# EAGLE design LIC_V-00119-01 (EAGLE 7.2.0)
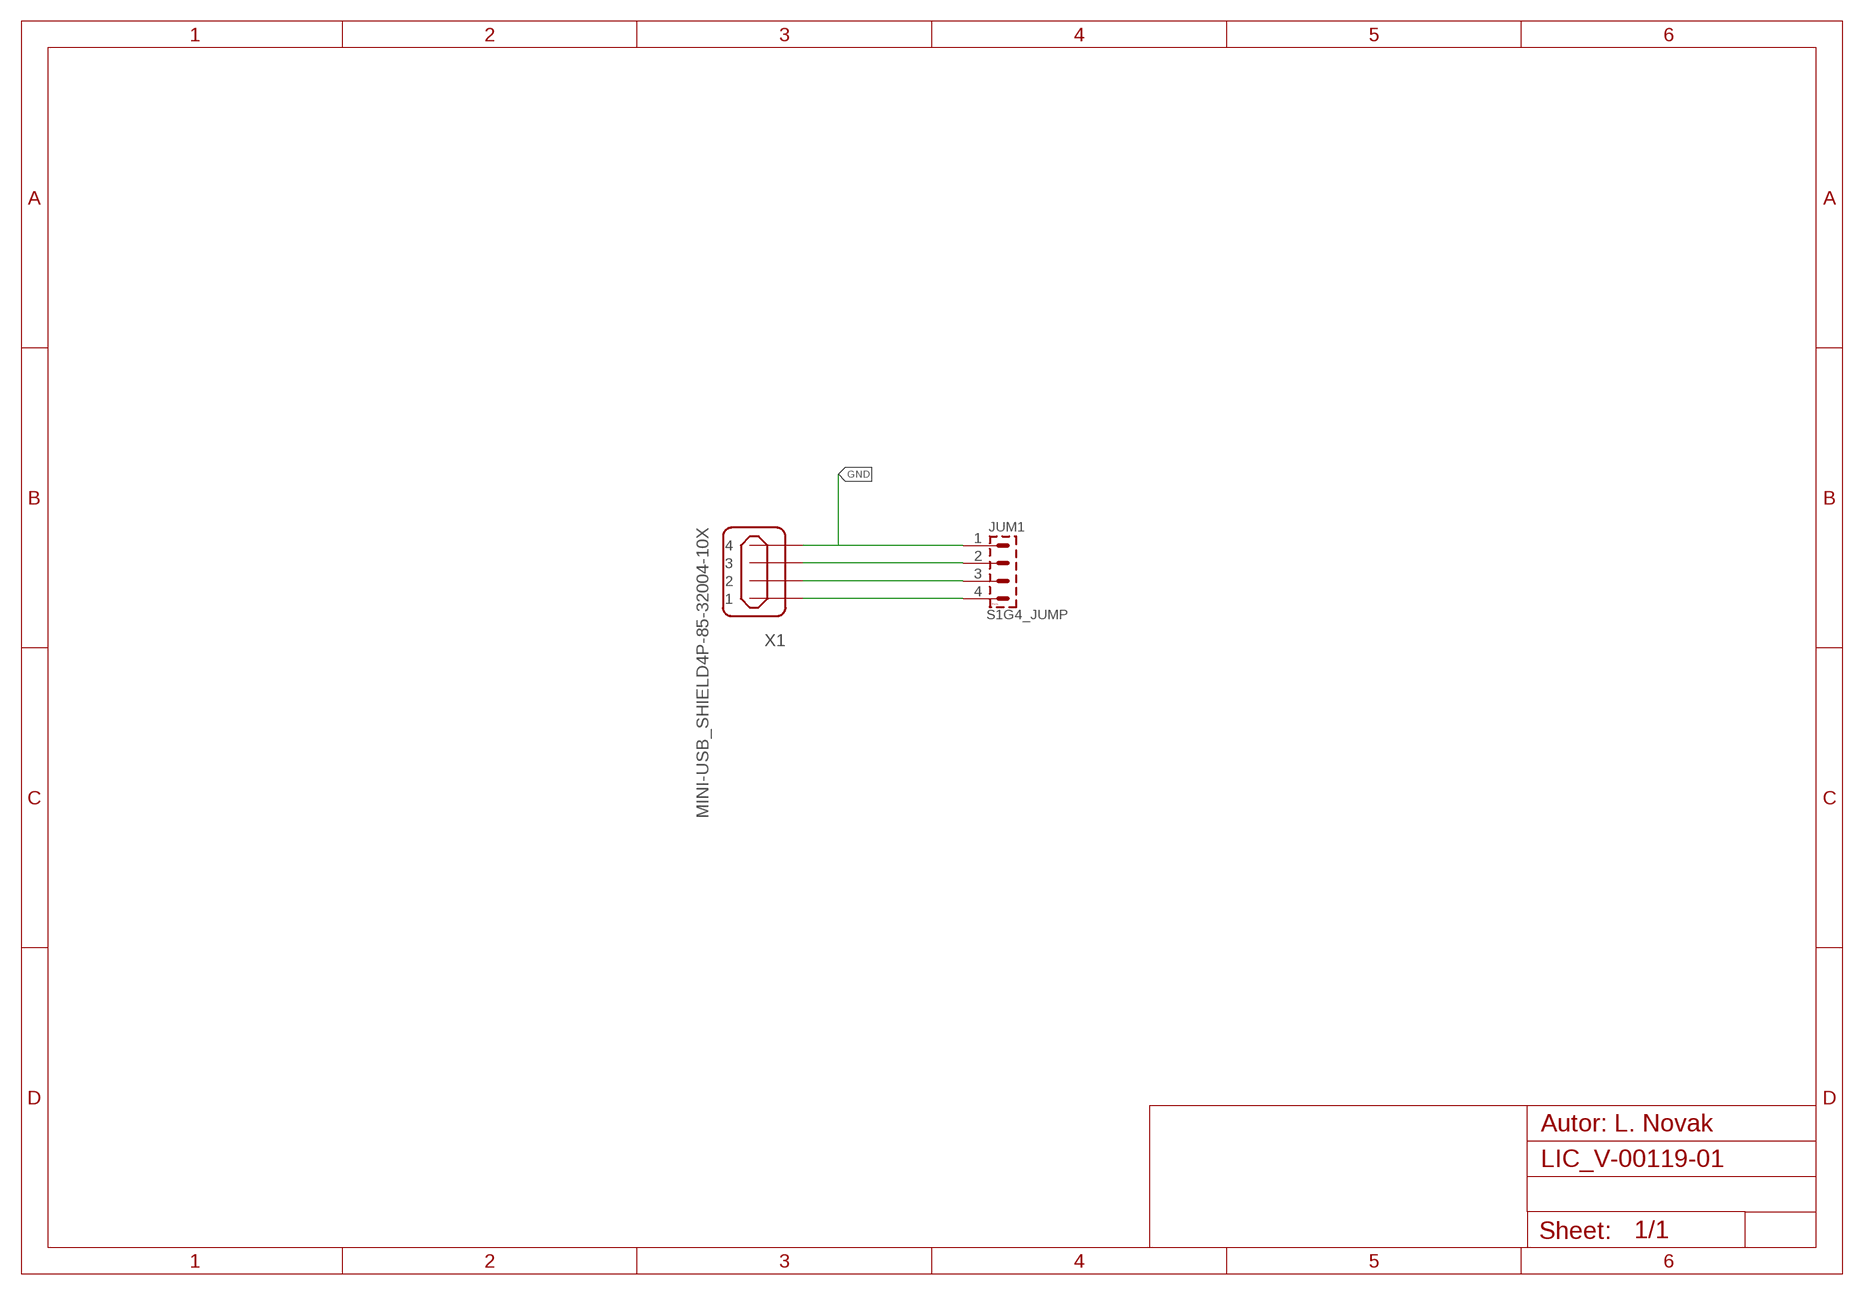
[diagram p0: schematic, sheet 1]

## Parts
JUM1  S1G4_JUMP  [S1G4_JUM]
X1  MINI-USB_SHIELD4P-85-32004-10X  [85-32004-10X]

## Nets
GND: JUM1.1 X1.4
N$2: JUM1.2 X1.3
N$3: JUM1.3 X1.2
N$4: JUM1.4 X1.1
Unconnected: X1.M1(S1) X1.M2(S2)

## Library data of the parts
JUM1 = #PaJa_konektory:S1G4_JUMP: Radove konektory - koliky - 4x
X1 = con-cypressindustries:MINI-USB_SHIELD4P-: MINI USB 4 Pol. Source: www.cypressindustries.com; OC_FARNELL: unknown; OC_NEWARK: unknown

## Board
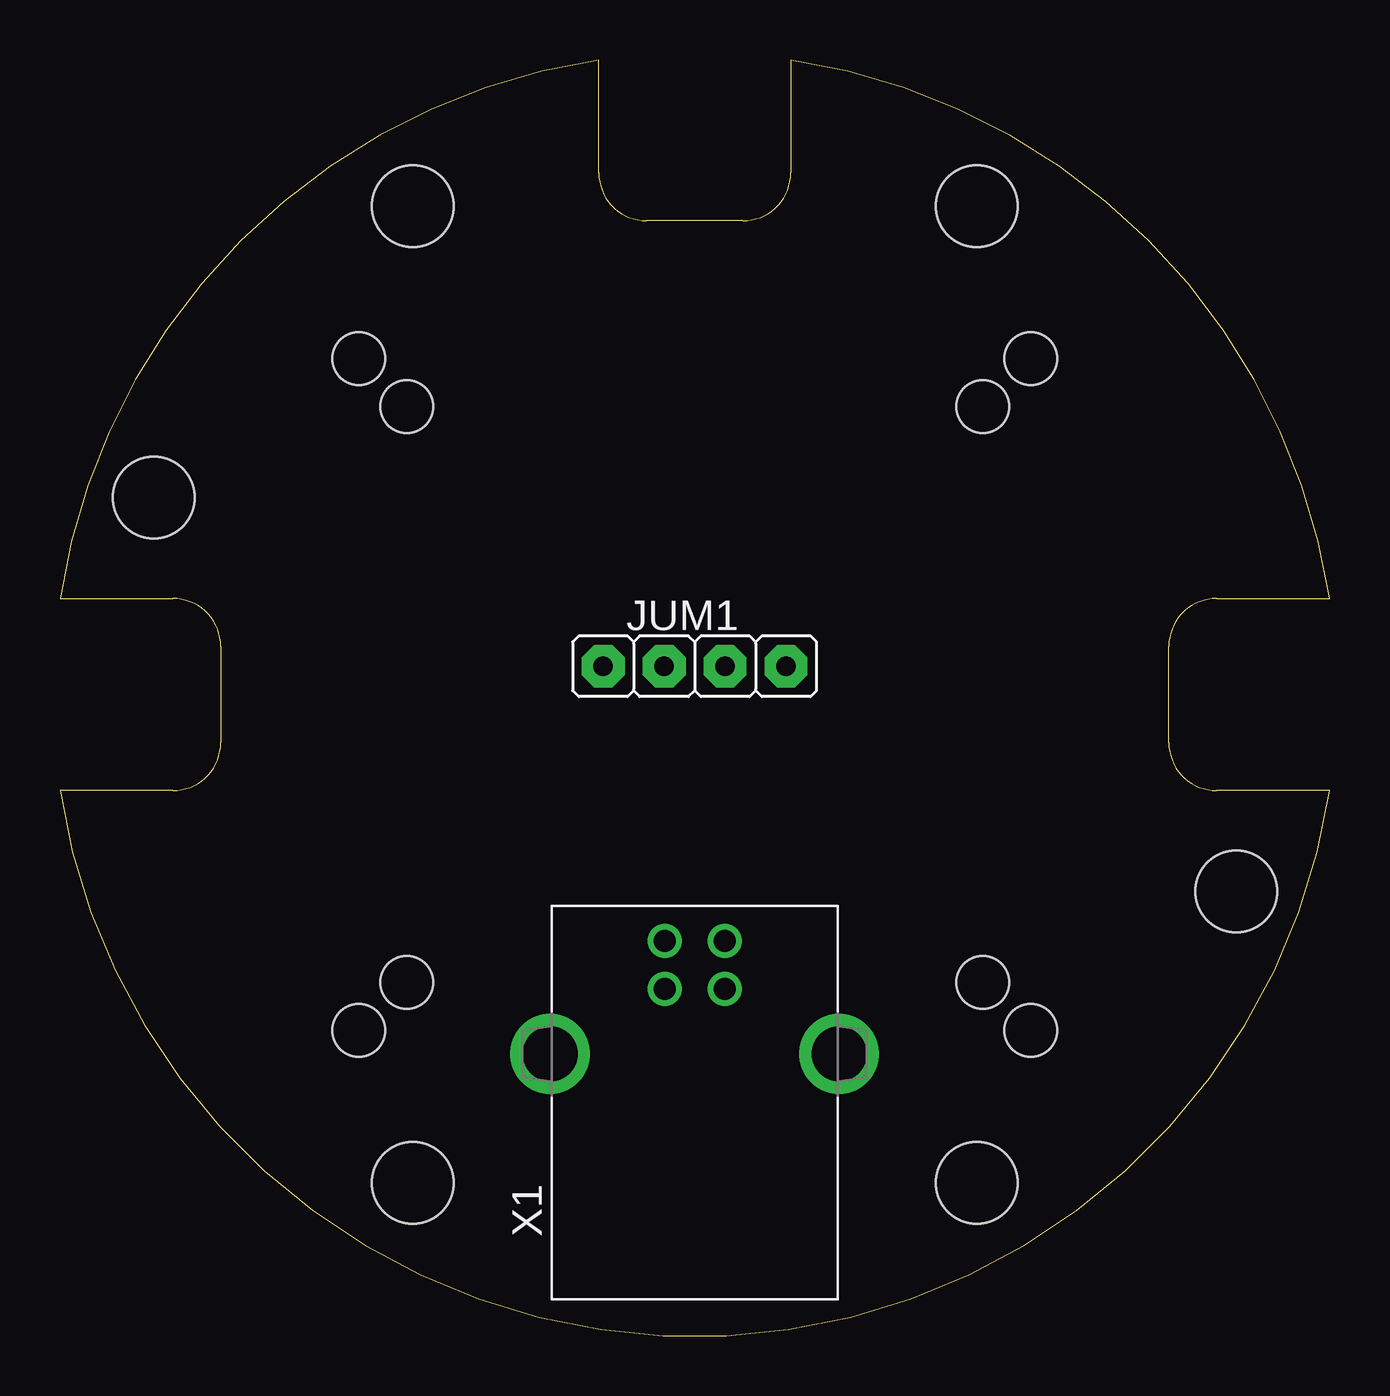
[diagram p1: board, top side]
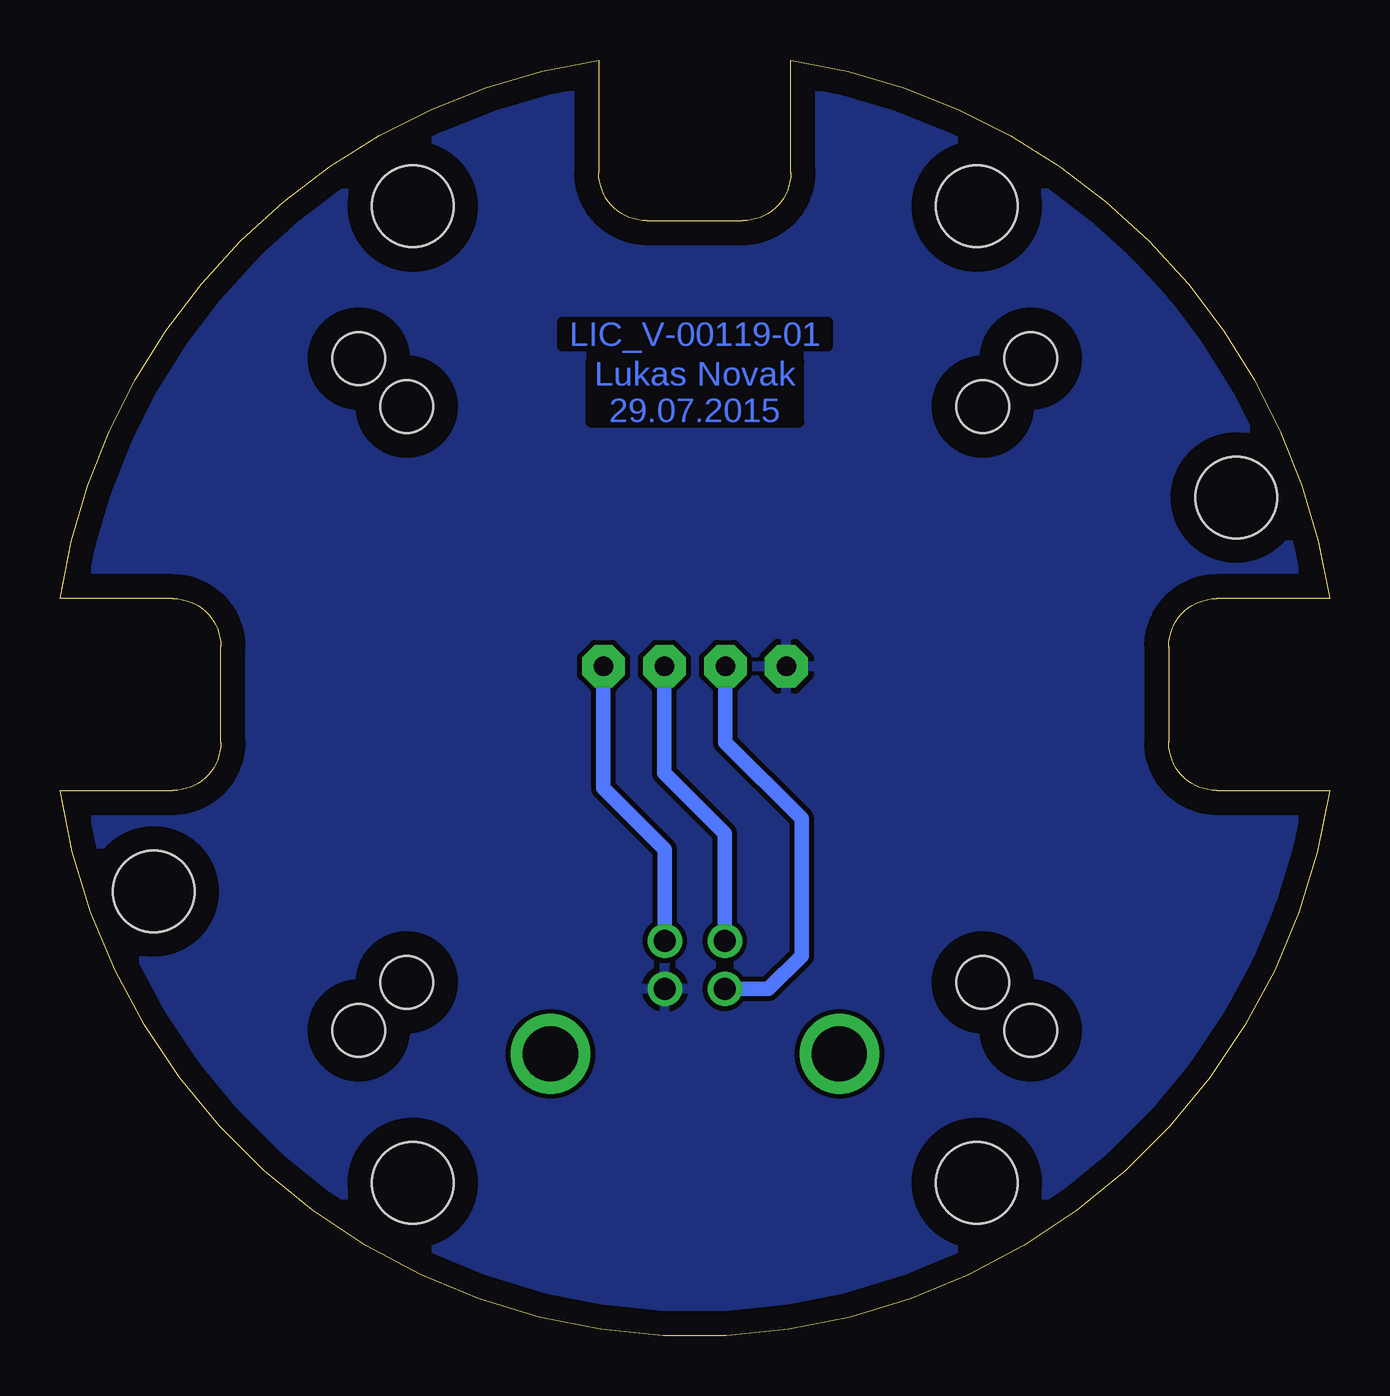
[diagram p2: board, bottom side, seen from below]

Size 52.9 x 53.17 mm. Coordinates in mm from the lower left corner, seen from the top.
Outline: 48.2,30.72 arc90 46.2,28.72 46.2,24.72 arc90 48.2,22.72 52.9,22.72 arc-163 0,22.72 4.7,22.72 arc90 6.7,24.72 6.7,28.72 arc90 4.7,30.72 0,30.72 arc-73 22.45,53.17 22.45,48.47 arc90 24.45,46.47 28.45,46.47 arc90 30.45,48.47 30.45,53.17 arc-73 52.9,30.72 48.2,30.72
Copper layers (1*16): Top 0.035mm / dielectric 1.5mm / Bottom 0.035mm
Design rules "default": minimum track width 10mil, minimum drill 24mil, track to track 8mil, track to pad 8mil, pad to pad 8mil, via to via 8mil, smd to smd 8mil, copper to edge 40mil, drill to drill 8mil, minimum pad ring 10mil, minimum via ring 8mil, stop-mask expansion 4mil, vias tented up to drill 0mil, thermal gap 10mil
Holes 3.4 mm at 3.9,34.93 14.7,47.07 38.2,47.07 49,18.51 38.2,6.37 14.7,6.37
Holes 2.2 mm at 12.45,40.72 14.45,38.72 40.45,40.72 38.45,38.72 38.45,14.72 40.45,12.72 14.45,14.72 12.45,12.72

### Footprints (pad centres in the part's own frame; a part is rotated, then mirrored left to right if it is on the bottom)
S1G4_JUM = drill 0.813 pad 1.778 octagon: 1 -3.81,0; 2 -1.27,0; 3 1.27,0; 4 3.81,0
85-32004-10X = drill 0.92 pad 1.27: 1 4.71,-1.25; 2 4.71,1.25; 3 2.71,1.25; 4 2.71,-1.25 | drill 2.3 pad 3: M1 0,6.02; M2 0,-6.02

### Placement (x,y rotation side)
JUM1  26.44,27.9 0 top
X1  26.44,11.74 90 top

### Tracks (layer width: path | path; a pad name or v marks a point on that pad's centre or on a via)
GND
  pour Bottom: -0.23,22.82 arc162 53.11,22.82 46.13,22.82 46.13,30.44 53.11,30.44 arc75 30.25,53.3 30.25,46.31 22.63,46.31 22.63,53.3 arc75 -0.23,30.44 6.76,30.44 6.76,22.82
N$2
  Bottom 0.61: X1.3 23.38,14.45 22,15.83 22,21.55 25.17,24.72 JUM1.2
N$3
  Bottom 0.61: X1.2 25.19,20.93 27.71,23.45 JUM1.3
N$4
  Bottom 0.61: X1.1 27.69,20.26 30.25,22.82 JUM1.4

### Text on the board
Bottom: Lukas Novak / 29.07.2015